# EAGLE design MEMS-preamp_v07 (EAGLE 8.5.0)
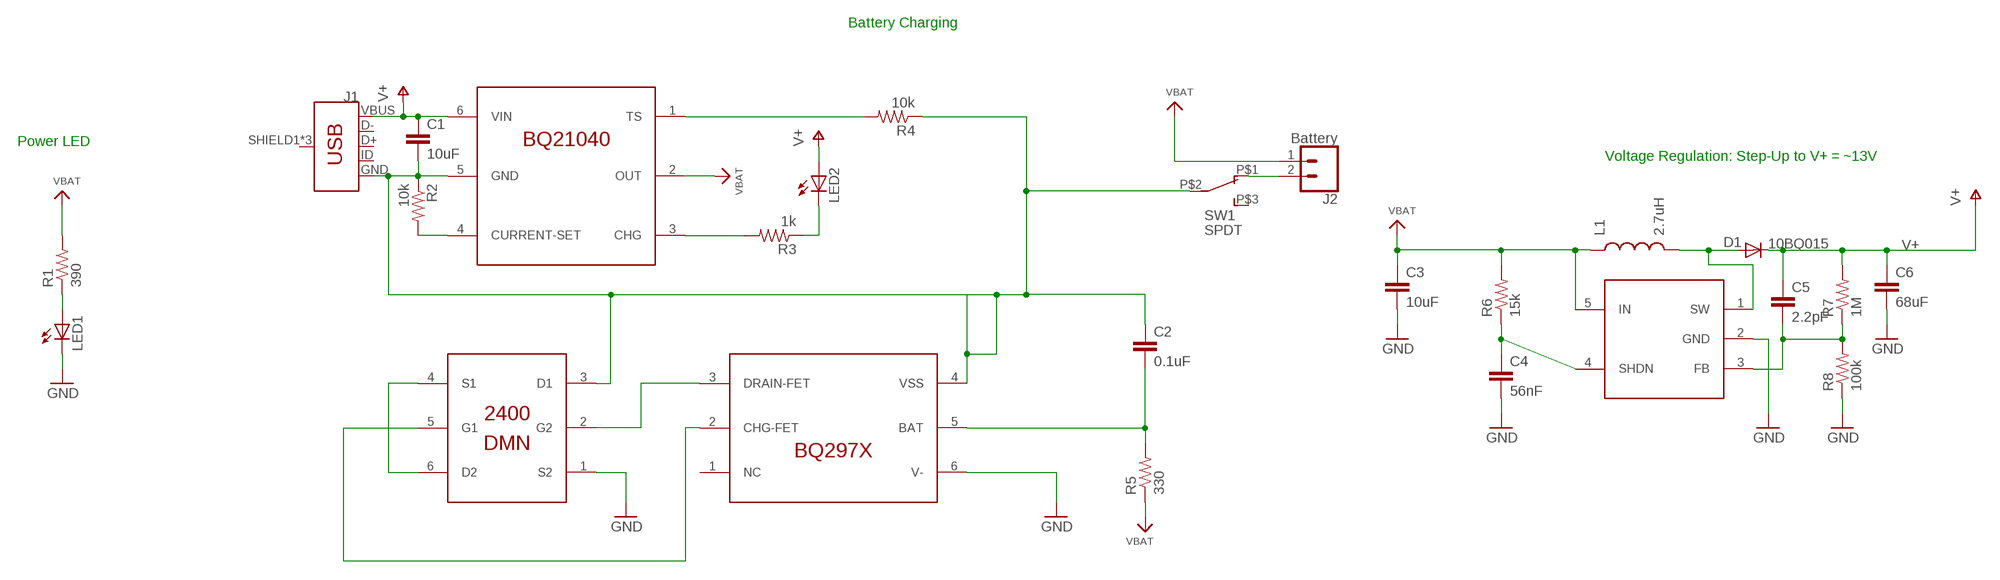
[diagram p0: schematic, sheet 1, part 1 of 2]
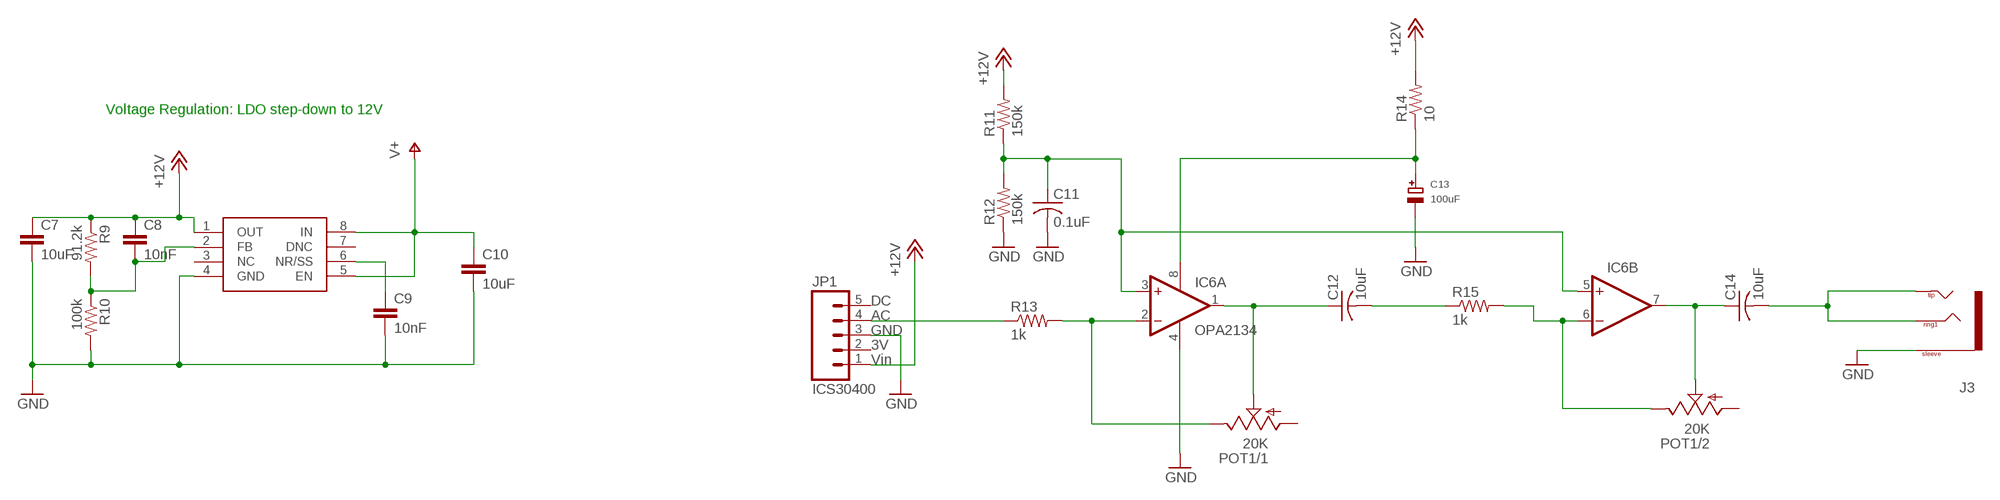
[diagram p1: schematic, sheet 1, part 2 of 2]

## Parts
C1  10uF  C-EUC0603  [C0603]
C2  0.1uF  C-EUC0603  [C0603]
C3  10uF  C-EUC0603  [C0603]
C4  56nF  C-EUC0603  [C0603]
C5  2.2pF  C-EUC0603  [C0603]
C6  68uF  C-EUC1206  [C1206]
C7  10uF  C-EUC0603  [C0603]
C8  10nF  C-EUC0603  [C0603]
C9  10nF  C-EUC0603  [C0603]
C10  10uF  C-EUC0603  [C0603]
C11  0.1uF  C-USC0805  [C0805]
C12  10uF  C-USC0805  [C0805]
C13  100uF  CAP_TANTALUMA/3216_REFLOW  [EIA3216-18/A-R]
C14  10uF  C-USC0805  [C0805]
D1  10BQ015  DIODESMA  [SMA-DIODE]
IC1  DMN2400  DUAL-NFET-DMN2400  [SOT-563]
IC2  BQ21040  BQ21040-LIPO-CHARGER  [SOT23-6]
IC3  BQ297X  BQ297X-BATTERY-MANAGER  [WSON-6]
IC4  SC4503  [SOT23-5]
IC5  TPS7A49  [MSOP-8]
IC6  OPA2134  OPA2134UA  [SO08]
J1  USB_MICRO-BREDUCED_PASTE  [USB-B-MICRO-SMD_RED_PASTE]
J2  Battery  CONN_02LOCK  [1X02_LOCK]
J3  TRS-1/8"-3.5MM  [TRS_SJ-3524-SMT]
JP1  ICS30400  M05LOCK  [1X05_LOCK]
L1  2.7uH  INDUCTORCR54-KIT  [CR54-KIT]
LED1  LED3MM  [LED3MM]
LED2  LED3MM  [LED3MM]
POT1  20K  POT-DUAL-PTV112-4420  [PTV112]
R1  390  R-US_R0603  [R0603]
R2  10k  R-US_R0603  [R0603]
R3  1k  R-US_R0603  [R0603]
R4  10k  R-US_R0603  [R0603]
R5  330  R-US_R0603  [R0603]
R6  15k  R-US_R0603  [R0603]
R7  1M  R-US_R0603  [R0603]
R8  100k  R-US_R0603  [R0603]
R9  91.2k  R-US_R0603  [R0603]
R10  100k  R-US_R0603  [R0603]
R11  150k  R-US_R0603  [R0603]
R12  150k  R-US_R0603  [R0603]
R13  1k  R-US_R0603  [R0603]
R14  10  R-US_R0603  [R0603]
R15  1k  R-US_R0603  [R0603]
SW1  SPDT  SWITCH_SPDTCL-SB-12B  [SWITCH_SPDT_CL-SB-12B]

## Nets
+12V: C7.1 C8.1 IC5.1(OUT) JP1.1 R9.1 R11.2 R14.2
GND: C3.2 C4.2 C6.2 C7.2 C9.2 C10.2 C11.2 C13.- IC1.1(S2) IC3.6(V-) IC5.4(GND) IC6.4(A:V-) J3.1(SLEEVE) JP1.3 LED1.K(C) R8.1 R10.2 R12.1
GND2: C1.2 C2.1 IC1.3(D1) IC2.5(GND) IC3.4(VSS) J1.GND R2.1 R4.1 SW1.P$2
GROU[: IC6.6(B:-IN) POT1.2.3(/2:E) R15.2
N$1: C13.+ IC6.8(A:V+) R14.1
N$2: LED1.A R1.1
N$3: JP1.4 R13.1
N$4: C12.2 R15.1
N$5: IC6.2(A:-IN) POT1.1.3(/1:E) R13.2
N$6: J2.2 SW1.P$1
N$7: C14.2 J3.2(TIP) J3.3(RING1) J3.4(TIP)
N$8: C11.1 IC6.3(A:+IN) IC6.5(B:+IN) R11.1 R12.2
N$9: C12.1 IC6.1(A:OUT) POT1.1.2(/1:S)
N$10: C14.1 IC6.7(B:OUT) POT1.2.2(/2:S)
N$11: LED2.K(C) R3.1
N$12: D1.A IC4.1(SW) L1.P$2
N$13: C4.1 IC4.4(SHDN) R6.1
N$14: C5.2 IC4.3(FB) R7.1 R8.2
N$15: IC2.3(CHG) R3.2
N$16: IC2.1(TS) R4.2
N$17: IC2.4(CURRENT-SET) R2.2
N$18: C2.2 IC3.5(BAT) R5.2
N$19: IC1.4(S1) IC1.6(D2)
N$20: IC1.5(G1) IC3.2(CHG-FET)
N$22: IC1.2(G2) IC3.3(DRAIN-FET)
N$47: C8.2 IC5.2(FB) R9.2 R10.1
N$48: C9.1 IC5.6(NR/SS)
V+: C1.1 C5.1 C6.1 C10.1 D1.C IC2.6(VIN) IC5.5(EN) IC5.8(IN) J1.VBUS LED2.A R7.2
VBAT: C3.1 IC2.2(OUT) IC4.5(IN) J2.1 L1.P$1 R1.2 R5.1 R6.2
Unconnected: IC3.1(NC) IC4.2(GND) IC5.3(NC) IC5.7(DNC) J1.D+ J1.D- J1.ID J1.SHIELD1(SHIELD) J1.SHIELD2(SHIELD) J1.SHIELD3(SHIELD) JP1.2 JP1.5 POT1.1.1(/1:A) POT1.2.1(/2:A) SW1.P$3

## Notes on the sheet
- Battery Charging
- Power LED
- Voltage Regulation: Step-Up to V+ = ~13V | Voltage Regulation: LDO step-down to 12V

## Library data of the parts
C1-C10 = rcl:C-EU: CAPACITOR, European symbol; SPICEPREFIX: C
C11 C12 C14 = adafruit:C-US: CAPACITOR, American symbol
C13 = microbuilder:CAP_TANTALUM: Tantalum Capacitors Wave footprints have larger pads and are meant to be used for hand soldering. Reflow footprints are optimised for solder paste and a reflow oven. EIA3216-18/A-[R/W] - Size A / 3216-18 / 1206 footprint 4.7µF 25V 10% Tantalum Capacitor 10µF 16V 10% Tantalum Capacitor [Digikey: 495-2236-2-ND] EIA3528-21/B-[R/W] - Size B / 3528-21 47µF 10V 10% Tantalum Capactior [Digikey: 495-2216-1-ND] EIA6032-28/C-[R/W] - Size C / 6032-28 10µF 35V 20% Tantalum Capacitor [Digikey: 495-2285-1-ND] 100µF 16V 10% Tantalum Capactior [Digikey: 399-5214-1-ND]
D1 = SparkFun:DIODE: Diode These are standard reverse protection diodes and small signal diodes. SMA package can handle up to about 1A. SOD-323 can handle about 200mA. What the SOD-323 package when ordering, there are some mfgs out there that are 5-pin packages.
IC1 = CMU-ArtFab:DUAL-NFET-DMN2400
IC2 = CMU-ArtFab:BQ21040-LIPO-CHARGER
IC3 = CMU-ArtFab:BQ297X-BATTERY-MANAGER
IC4 = CMU-ArtFab:SC4503
IC5 = CMU-ArtFab:TPS7A49
IC6 = linear:OPA2*: Dual Operational Amplifier Low Power, Single-Supply, Rail-To-Rail Operational Amplifier Source: http://focus.ti.com/lit/ds/symlink/opa2345.pdf http://focus.ti.com .. opa241.pdf http://focus.ti.com/lit/ds/symlink/opa2134.pdf; IC_NAME: OPA2134
J1 = SparkFun-Connectors:USB_MICRO-B: USB Type Micro-B Connector Male/female and PTH/SMT variants SparkFun Products: SparkFun microB USB Breakout <https://www.sparkfun.com/products/12035> SparkFun USB microB Plug Breakout <https://www.sparkfun.com/products/10031> SparkFun ESP8266 Thing <https://www.sparkfun.com/products/13231>; PROD_ID: CONN-11752
J2 = SparkFun-Connectors:CONN_02: Multi connection point. Often used as Generic Header-pin footprint for 0.1 inch spaced/style header connections On any of the 0.1 inch spaced packages, you can populate with these: Break Away Headers - Straight <https://www.sparkfun.com/products/116> (PRT-00116) Break Away Male Headers - Right Angle <https://www.sparkfun.com/products/553> (PRT-00553) Female Headers <https://www.sparkfun.com/products/115> (PRT-00115) Break Away Headers - Machine Pin <https://www.sparkfun.com/products/117> (PRT-00117) Break Away Female Headers - Swiss Machine Pin <https://www.sparkfun.com/products/743> (PRT-00743) For SCREWTERMINALS and SPRING TERMINALS visit here: Screw Terimnals on SparkFun.com <https://www.sparkfun.com/search/results?term=Screw+Terminals> (5mm/3.5mm/2.54mm spacing) This device is also useful as a general connection point to wire up your design to another part of your project. Our various solder wires solder well into these plated through hole pads. Hook-Up Wire - Assortment (Stranded, 22 AWG) <https://www.sparkfun.com/products/11375> (PRT-11375) Hook-Up Wire - Assortment (Solid Core, 22 AWG) <https://www.sparkfun.com/products/11367> (PRT-11367) View the entire wire category on our website here <https://www.sparkfun.com/categories/141> Special notes: Molex polarized connector foot print use with: PRT-08233 with associated crimp pins and housings. 2.54_SCREWTERM for use with PRT-10571. 3.5mm Screw Terminal footprints for PRT-08084 5mm Screw Terminal footprints for use with PRT-08432
J3 = CMU-ArtFab:TRS-1/8"-3.5MM
JP1 = SparkFun-Connectors:M05: Header 5 Standard 5-pin 0.1" header. Use with straight break away headers (SKU : PRT-00116), right angle break away headers (PRT-00553), swiss pins (PRT-00743), machine pins (PRT-00117), and female headers (PRT-00115). Molex polarized connector foot print use with SKU : PRT-08230 with associated crimp pins and housings.; CON1: Vin; CON2: 3V; CON3: GND; CON4: AC; CON5: DC
L1 = SparkFun-Passives:INDUCTOR: Inductors Basic Inductor/Choke - 0603 and 1206. Footprints are not proven and vary greatly between part numbers. SRN6045- 33uH, 20% 1.4A SDR0403-560KL - 56uH, 10%, 500mA RMS/740mA peak
LED1 LED2 = led:LED: LED OSRAM: - CHIPLED LG R971, LG N971, LY N971, LG Q971, LY Q971, LO R971, LY R971 LH N974, LH R974 LS Q976, LO Q976, LY Q976 LO Q996 - Hyper CHIPLED LW Q18S LB Q993, LB Q99A, LB R99A - SideLED LS A670, LO A670, LY A670, LG A670, LP A670 LB A673, LV A673, LT A673, LW A673 LH A674 LY A675 LS A676, LA A676, LO A676, LY A676, LW A676 LS A679, LY A679, LG A679 - Hyper Micro SIDELED® LS Y876, LA Y876, LO Y876, LY Y876 LT Y87S - SmartLED LW L88C, LW L88S LB L89C, LB L89S, LG L890 LS L89K, LO L89K, LY L89K LS L896, LA L896, LO L896, LY L896 - TOPLED LS T670, LO T670, LY T670, LG T670, LP T670 LSG T670, LSP T670, LSY T670, LOP T670, LYG T670 LG T671, LOG T671, LSG T671 LB T673, LV T673, LT T673, LW T673 LH T674 LS T676, LA T676, LO T676, LY T676, LB T676, LH T676, LSB T676, LW T676 LB T67C, LV T67C, LT T67C, LS T67K, LO T67K, LY T67K, LW E67C LS E67B, LA E67B, LO E67B, LY E67B, LB E67C, LV E67C, LT E67C LW T67C LS T679, LY T679, LG T679 LS T770, LO T770, LY T770, LG T770, LP T770 LB T773, LV T773, LT T773, LW T773 LH T774 LS E675, LA E675, LY E675, LS T675 LS T776, LA T776, LO T776, LY T776, LB T776 LHGB T686 LT T68C, LB T68C - Hyper Mini TOPLED® LB M676 - Mini TOPLED Santana® LG M470 LS M47K, LO M47K, LY M47K Source: http://www.osram.convergy.de LUXEON: - LUMILED® LXK2-PW12-R00, LXK2-PW12-S00, LXK2-PW14-U00, LXK2-PW14-V00 LXK2-PM12-R00, LXK2-PM12-S00, LXK2-PM14-U00 LXK2-PE12-Q00, LXK2-PE12-R00, LXK2-PE12-S00, LXK2-PE14-T00, LXK2-PE14-U00 LXK2-PB12-K00, LXK2-PB12-L00, LXK2-PB12-M00, LXK2-PB14-N00, LXK2-PB14-P00, LXK2-PB14-Q00 LXK2-PR12-L00, LXK2-PR12-M00, LXK2-PR14-Q00, LXK2-PR14-R00 LXK2-PD12-Q00, LXK2-PD12-R00, LXK2-PD12-S00 LXK2-PH12-R00, LXK2-PH12-S00 LXK2-PL12-P00, LXK2-PL12-Q00, LXK2-PL12-R00 Source: www.luxeon.com KINGBRIGHT: KA-3528ASYC Source: www.kingbright.com
POT1 = CMU-ArtFab:POT-DUAL-PTV112: Bourns 11mm dual potentiometer; AVAILABILITY: Unavailable; DESCRIPTION: Alt# Tce-10111410; MF: STMicroelectronics; MP: PTV112; PACKAGE: None; PRICE: None
R1-R15 = CMU-ArtFab:R-US_: RESISTOR, American symbol
SW1 = CMU-ArtFab:SWITCH_SPDT

## Board
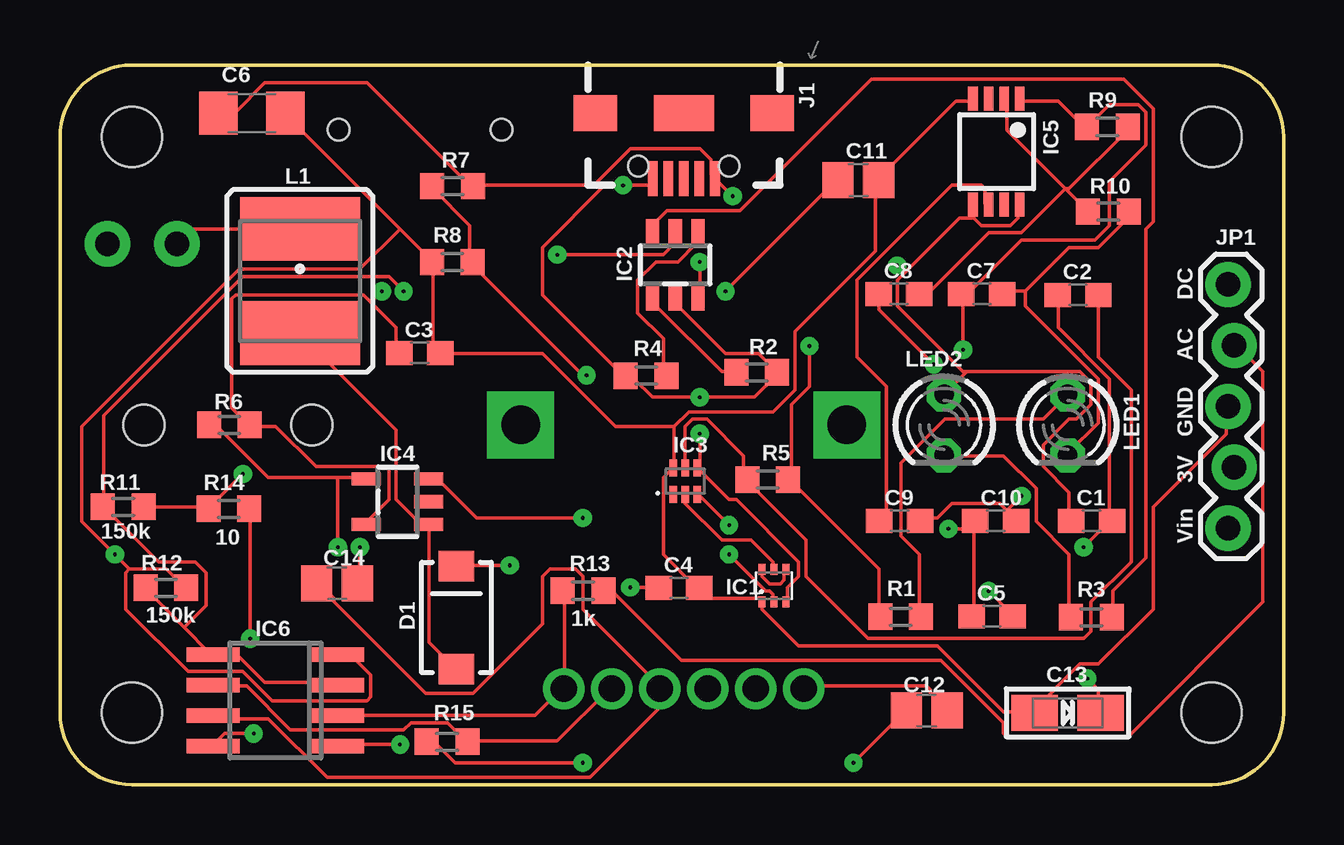
[diagram p2: board, top side]
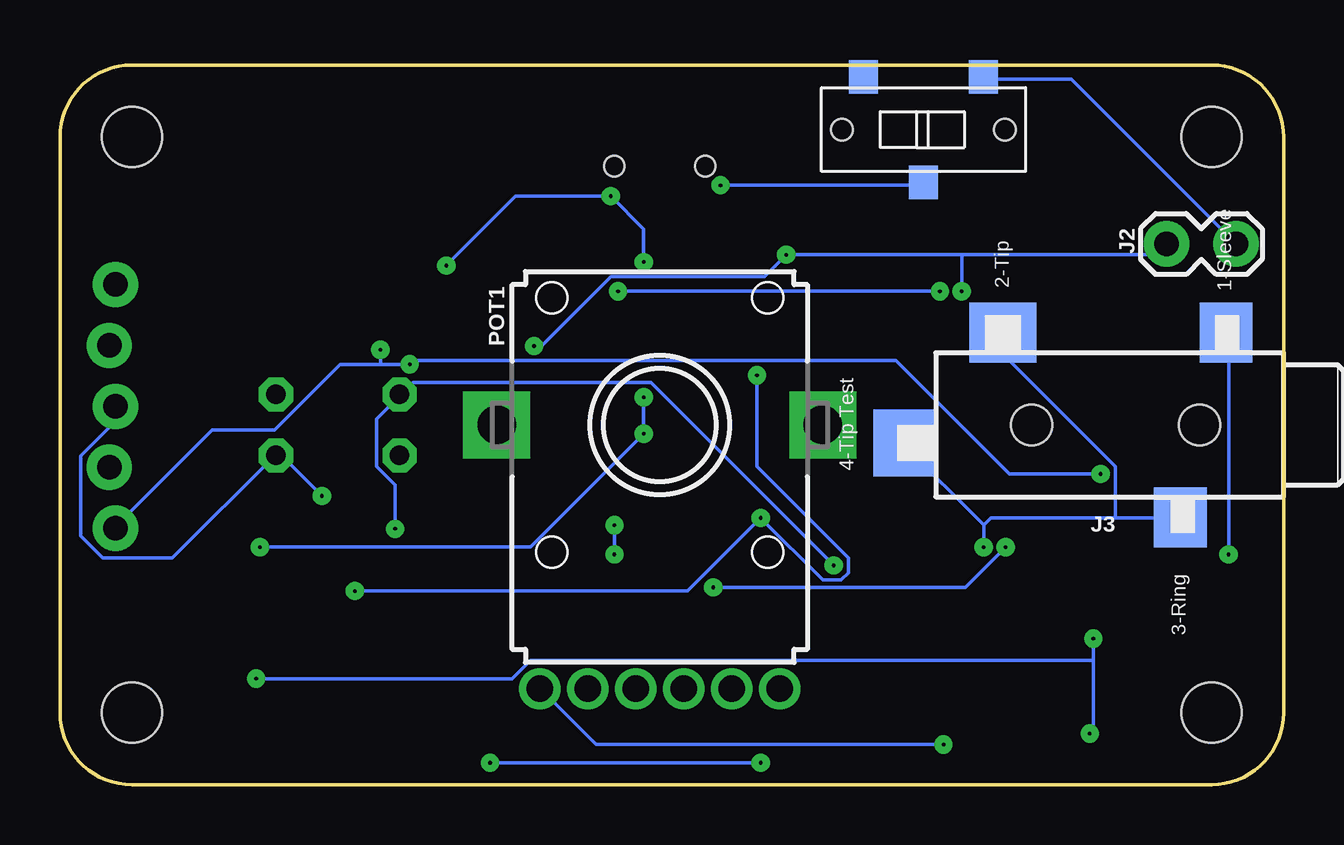
[diagram p3: board, bottom side, seen from below]

Size 51 x 30 mm. Coordinates in mm from the lower left corner, seen from the top.
Outline: 0,3 0,27 arc-90 3,30 48,30 arc-90 51,27 51,3 arc-90 48,0 3,0 arc-90 0,3
Copper layers (1*16): Top 0.035mm / dielectric 1.5mm / Bottom 0.035mm
Design rules "default *": minimum track width 6mil, minimum drill 6mil, track to track 6mil, track to pad 6mil, pad to pad 6mil, via to via 6mil, smd to smd 6mil, copper to edge 6mil, drill to drill 6mil, minimum pad ring 12mil, minimum via ring 12mil, stop-mask expansion 4mil, vias tented up to drill 0mil, thermal gap 10mil
Holes 2.5 mm at 48,27 48,3 3,27 3,3

### Footprints (pad centres in the part's own frame; a part is rotated, then mirrored left to right if it is on the bottom)
C0603 = smd 1.1 x 1: 1 -0.85,0; 2 0.85,0
C1206 = smd 1.6 x 1.8: 1 -1.4,0; 2 1.4,0
C0805 = smd 1.3 x 1.5: 1 -0.85,0; 2 0.85,0
EIA3216-18/A-R = smd 1.95 x 1.5: + 1.375,0; - -1.375,0
SMA-DIODE = smd 1.27 x 1.47: A -2.15,0; C 2.15,0
SOT-563 = smd 0.3 x 0.45: 1 -0.5,-0.675; 2 0,-0.675; 3 0.5,-0.675; 4 0.5,0.675; 5 0,0.675; 6 -0.5,0.675
SOT23-6 = smd 0.55 x 1.2: 1 -0.95,-1.3; 2 0,-1.3; 3 0.95,-1.3; 4 0.95,1.3; 5 0,1.3; 6 -0.95,1.3
WSON-6 = smd 0.3 x 0.7: 1 -0.5,-0.55; 2 0,-0.55; 3 0.5,-0.55; 4 0.5,0.55; 5 0,0.55; 6 -0.5,0.55
SOT23-5 = smd 0.55 x 1.2: 1 -0.95,-1.3; 2 0,-1.3; 3 0.95,-1.3; 4 0.95,1.3; 5 -0.95,1.3
MSOP-8 = smd 0.4 x 1: 1 -0.975,-2.2; 2 -0.325,-2.2; 3 0.325,-2.2; 4 0.975,-2.2; 5 0.975,2.2; 6 0.325,2.2; 7 -0.325,2.2; 8 -0.975,2.2
SO08 = smd 0.6 x 2.2: 1 -1.905,-2.6; 2 -0.635,-2.6; 3 0.635,-2.6; 4 1.905,-2.6; 5 1.905,2.6; 6 0.635,2.6; 7 -0.635,2.6; 8 -1.905,2.6
USB-B-MICRO-SMD_RED_PASTE = smd 1.45 x 0.4: D+ 2.725,0; D- 2.725,0.65; GND 2.725,-1.3; ID 2.725,-0.65; VBUS 2.725,1.3 | smd 1.5 x 1.8: SHIELD1 0,3.685; SHIELD2 0,-3.685 | smd 1.5 x 2.5: SHIELD3 0,0 | hole 0.85: 2.2,1.9; 2.2,-1.9
1X02_LOCK = drill 1.016 pad 1.88: 1 -0.178,0; 2 2.718,0
TRS_SJ-3524-SMT = smd 2.5 x 2.2: 1 3.85,-4.6; 3 -3.85,-2.7 | smd 2.5 x 2.8: 2 3.85,4.7 | smd 2.8 x 2.5: 4 -0.75,8.85 | hole 1.7: 0,-3.5; 0,3.5
1X05_LOCK = drill 1.016 pad 1.88: 1 0,0.127; 2 2.54,-0.127; 3 5.08,0.127; 4 7.62,-0.127; 5 10.16,0.127
CR54-KIT = smd 5 x 2.65: P$1 0,2.17; P$2 0,-2.17
LED3MM = drill 0.813 octagon: A -1.27,0; K 1.27,0
PTV112 = drill 1.1 pad 1.676: 1.1 -3,-11; 1.2 -5,-11; 1.3 5,-11; 2.1 -1,-11; 2.2 1,-11; 2.3 3,-11 | drill 1.6 pad 2.8 square: M1 -6.8,0; M2 6.8,0
R0603 = smd 1 x 1.1: 1 -0.85,0; 2 0.85,0
SWITCH_SPDT_CL-SB-12B = smd 1.2 x 1.4: P$1 -2.5,-2.2; P$2 0,2.2; P$3 2.5,-2.2 | hole 0.9: -3.4,0; 3.4,0

### Placement (x,y rotation side)
C1  43,11 0 top
C2  42.43,20.42 0 top
C3  15,18 0 top
C4  25.8,8.2 0 top
C5  38.85,7.02 0 top
C6  8,28 0 top
C7  38.42,20.46 0 top
C8  34.97,20.46 0 top
C9  35,11 0 top
C10  39,11 0 top
C11  33.27,25.2 0 top
C12  36.13,3.1 180 top
C13  42,3 0 top
C14  11.54,8.4 0 top
D1  16.53,6.97 90 top
IC1  29.77,8.3 0 top
IC2  25.64,21.67 180 top
IC3  26.06,12.66 0 top
IC4  14.06,11.8 90 top
IC5  39.02,26.39 180 top
IC6  8.98,3.52 90 top
J1  26,27.99 270 top
J2  4.7,22.55 0 bottom
J3  7,15 90 bottom
JP1  48.81,10.7 90 top
L1  10,21 0 top
LED1  42,15 270 top
LED2  36.85,15 270 top
POT1  26,15 0 bottom
R1  35.04,7 180 top
R2  29.04,17.19 180 top
R3  42.99,6.98 0 top
R4  24.43,17.06 0 top
R5  29.5,12.72 180 top
R6  7.06,15 0 top
R7  16.36,24.96 0 top
R8  16.35,21.79 0 top
R9  43.65,27.43 0 top
R10  43.69,23.89 0 top
R11  2.64,11.59 0 top
R12  4.42,8.21 180 top
R13  21.8,8.09 180 top
R14  7.04,11.51 180 top
R15  16.14,1.79 0 top
SW1  15.01,27.32 180 bottom

### Tracks (layer width: path | path; a pad name or v marks a point on that pad's centre or on a via)
+12V  (via drill 0.15)
  Top 0.152: IC5.1 40.08,28.5 41.6,28.5 42.67,27.43 R9.1 42.82,27.43 43.74,28.35 44.96,28.35 45.26,28.04 45.26,26.67 43.74,25.15 43.74,23.32 43.13,22.71 40.08,22.71 37.95,20.57 37.64,20.57 C7.1 37.64,20.42 v37.64,18.14 | R11.2 3.5,11.58 6.1,11.58 R14.2 6.25,11.58 v7.62,12.95 | v36.42,17.53 34.14,19.81 34.14,20.42 C8.1
  Bottom 0.152: 37.64,17.53 39.32,17.53 42.06,14.78 44.65,14.78 48.62,10.82 JP1.1 | 37.64,17.53 v36.42,17.53 36.27,17.68 16.15,17.68 11.43,12.95 v7.62,12.95 | 37.64,17.53 v37.64,18.14
GND  (via drill 0.15)
  Top 0.152: 40.23,20.57 39.32,20.57 C7.2 | 40.23,20.57 42.06,22.4 43.28,22.4 44.65,23.77 R10.2 | 39.47,11.43 39.78,11.12 C10.2 39.47,11.43 | 39.47,11.43 39.17,11.73 37.19,11.73 36.58,11.12 35.97,11.12 C9.2 | v40.08,12.04 39.47,11.43 | 40.23,20.57 40.23,19.96 43.28,16.92 43.28,15.09 42.06,13.87 LED1.K | 2.9,8.99 4.42,8.99 5.18,8.23 R12.1 | 2.9,8.99 2.74,8.84 2.74,7.32 5.33,4.72 7.62,4.72 8.84,3.5 12.8,3.5 12.95,3.66 12.95,4.57 12.19,5.33 11.73,5.33 IC6.4 | 2.9,8.99 v2.29,9.6 0.91,10.97 0.91,14.94 7.47,21.49 12.5,21.49 14.17,23.16 | 14.17,23.16 15.54,21.79 R8.1 15.54,21.64 15.54,18.44 15.85,18.14 C3.2 16,17.98 20.12,17.98 23.16,14.94 25.6,14.94 | 14.17,23.16 9.45,27.89 C6.2 | IC5.4 37.95,28.5 37.34,28.5 34.14,25.3 C11.2 33.98,25.15 33.98,22.25 30.63,18.9 30.63,16.46 29.72,15.54 26.21,15.54 25.6,14.94 | 40.54,3.05 39.32,3.05 36.58,5.79 30.79,5.79 29.26,7.32 IC1.1 29.26,7.77 26.98,7.77 26.67,8.08 C4.2 26.52,8.23 25.15,9.6 25.15,12.8 25.45,13.11 IC3.6 25.6,13.26 25.6,14.94 | 40.54,3.05 42.52,5.03 43.28,5.03 45.57,7.32 45.57,11.58 48.62,14.63 48.62,15.7 JP1.3 | 40.54,3.05 C13.-
  Bottom 0.152: v40.08,12.04 41.91,13.87 LED1.K 42.06,13.72 46.33,9.45 49.23,9.45 50.14,10.36 50.14,13.72 48.77,15.09 48.77,15.7 JP1.3 | v2.29,9.6 2.29,18.75 J3.1
GND2  (via drill 0.15)
  Top 0.152: C2.1 41.6,20.27 41.6,19.05 43.74,16.92 43.74,11.12 C1.2 43.74,10.97 v42.67,9.91 | J1.GND 24.69,25.15 24.54,24.99 v23.47,24.99 22.71,24.99 20.12,22.4 20.12,20.42 23.47,17.07 R4.1 23.62,16.92 23.93,16.92 24.69,16.15 v26.67,16.15 28.96,16.15 29.87,17.07 R2.1 29.87,17.22 29.11,17.98 27.74,17.98 25.76,19.96 25.76,20.27 IC2.5 | IC1.3 30.33,7.77 30.33,8.23 30.79,8.69 30.79,9.3 28.19,11.89 27.89,11.89 26.67,13.11 IC3.4 26.67,13.26 v26.67,14.63
  Bottom 0.152: v23.47,24.99 15.09,24.99 SW1.P$2 | v26.67,16.15 v26.67,14.63 31.39,9.91 v42.67,9.91
GROU[
  Top 0.152: POT1.2.3 22.86,3.96 20.73,1.83 17.07,1.83 R15.2 16.92,1.83 16.15,2.59 14.63,2.59 14.33,2.29 9.6,2.29 7.77,4.12 6.4,4.12 IC6.6
N$1  (via drill 0.15)
  Top 0.152: v7.92,6.1 7.92,11.43 R14.1 | v8.08,2.13 6.86,2.13 6.4,1.68 IC6.8 | v42.82,4.42 43.28,3.96 43.28,3.05 C13.+
  Bottom 0.152: 7.92,5.18 7.92,2.29 v8.08,2.13 | 7.92,5.18 v7.92,6.1 | v42.82,4.42 32.16,4.42 31.39,5.18 7.92,5.18
N$2
  Top 0.152: R1.1 35.81,7.01 35.81,9.6 35.05,10.36 35.05,13.41 36.88,15.24 41,15.24 41.91,16.15 LED1.A
N$3
  Top 0.152: R13.1 22.71,8.08 23.01,8.08 25.91,5.18 36.73,5.18 39.32,2.59 39.32,2.13 39.47,1.98 44.5,1.98 50.14,7.62 50.14,17.22 49.07,18.29 JP1.4
N$4  (via drill 0.15)
  Top 0.152: v21.79,0.91 16.46,0.91 15.7,1.68 15.39,1.68 R15.1 | v33.07,0.91 35.2,3.05 C12.2
  Bottom 0.152: v33.07,0.91 v21.79,0.91
N$5
  Top 0.152: R13.2 21.03,8.08 21.03,4.12 POT1.1.3 20.88,3.96 19.81,2.9 11.73,2.9 IC6.2
N$6
  Bottom 0.152: SW1.P$1 12.5,29.41 8.84,29.41 J2.2
N$7  (via drill 0.15)
  Top 0.152: v12.5,9.91 12.5,8.53 C14.2
  Bottom 0.152: 12.5,10.82 v12.5,9.91 | 12.5,10.82 15.85,14.17 J3.4 | 7.01,11.12 12.19,11.12 12.5,10.82 | 7.01,11.12 4.42,11.12 J3.3 | 7.01,11.12 7.01,13.26 11.58,17.83 11.58,18.75 J3.2
N$8  (via drill 0.15)
  Top 0.152: 5.18,6.55 6.25,5.49 IC6.5 6.4,5.33 7.47,5.33 8.53,4.27 11.58,4.27 IC6.3 | 5.18,6.55 3.66,8.08 R12.2 | 5.18,6.55 6.1,7.47 6.1,8.84 5.64,9.3 4.12,9.3 1.83,11.58 R11.1 1.83,11.73 1.83,15.39 7.62,21.18 13.72,21.18 v14.33,20.57 | v27.74,20.57 32.31,25.15 C11.1
  Bottom 0.152: v14.33,20.57 v27.74,20.57
N$9  (via drill 0.15)
  Top 0.152: C12.1 36.88,3.2 36.27,3.81 36.27,3.96 36.12,4.12 31.09,4.12 POT1.1.2 | v14.17,1.68 11.73,1.68 IC6.1
  Bottom 0.152: v14.17,1.68 28.65,1.68 30.94,3.96 POT1.1.2
N$10
  Top 0.152: C14.1 10.82,8.38 11.43,7.77 11.43,7.62 15.24,3.81 17.22,3.81 20.12,6.71 20.12,8.69 20.42,8.99 21.49,8.99 21.79,8.69 21.79,7.32 24.99,4.12 POT1.2.2 24.99,3.96 24.99,3.2 22.1,0.3 11.12,0.3 8.69,2.74 6.4,2.74 IC6.7
N$11
  Top 0.152: R3.1 42.06,7.01 42.06,9.6 40.69,10.97 40.69,12.34 39.32,13.72 36.88,13.72 LED2.K
N$12
  Top 0.152: D1.A 16.46,4.88 15.39,5.94 15.39,10.82 IC4.1 15.24,10.97 14.94,10.97 14.02,11.89 14.02,14.78 10.06,18.75 L1.P$2
N$13  (via drill 0.15)
  Top 0.152: 11.58,12.8 12.65,12.8 IC4.4 | 11.58,12.8 8.69,12.8 6.55,14.94 6.25,14.94 R6.1 | v23.77,8.23 24.84,8.23 C4.1 | 11.58,12.8 v11.58,9.91
  Bottom 0.152: v23.77,8.23 13.26,8.23 v11.58,9.91
N$14  (via drill 0.15)
  Top 0.152: R7.1 15.54,24.84 17.07,23.32 17.07,21.79 R8.2 17.22,21.64 21.79,17.07 v21.95,17.07 | v38.71,8.08 39.62,7.16 C5.2 | v21.79,11.12 17.37,11.12 15.85,12.65 15.39,12.65 IC4.3
  Bottom 0.152: v38.71,8.08 24.84,8.08 v21.79,11.12 19.2,8.53 18.44,8.53 18.14,8.84 18.14,9.45 21.95,13.26 v21.95,17.07
N$15
  Top 0.152: R3.2 43.89,7.01 43.89,8.08 45.26,9.45 45.26,23.16 45.57,23.47 45.57,28.19 44.35,29.41 33.83,29.41 28.35,23.93 25.3,23.93 24.84,23.47 24.84,23.01 IC2.3
N$16
  Top 0.152: R4.2 25.15,17.07 25.15,18.59 24.08,19.66 24.08,21.03 24.84,21.79 25.76,21.79 26.52,22.55 26.52,22.86 IC2.1
N$17
  Top 0.152: R2.2 28.04,17.22 27.58,17.22 24.84,19.96 24.84,20.27 IC2.4
N$18
  Top 0.152: IC3.5 26.06,13.26 26.06,14.94 26.36,15.24 26.98,15.24 28.5,13.72 28.5,12.8 R5.2 28.65,12.65 31.09,10.21 31.09,8.69 33.68,6.1 42.67,6.1 42.98,6.4 42.98,7.62 44.65,9.3 44.65,16.46 43.28,17.83 43.28,20.27 C2.2
N$19
  Top 0.152: IC1.6 29.26,8.84 29.26,8.69 29.57,8.38 30.02,8.38 30.18,8.53 30.18,8.84 IC1.4
N$20
  Top 0.152: IC1.5 29.72,8.99 29.72,9.3 28.8,10.21 27.58,10.21 26.06,11.73 26.06,12.04 IC3.2
N$22  (via drill 0.15)
  Top 0.152: v27.89,9.6 29.41,8.08 29.57,8.08 29.72,7.92 29.72,7.77 IC1.2 | v27.89,10.82 26.67,12.04 IC3.3
  Bottom 0.152: v27.89,10.82 v27.89,9.6
N$47
  Top 0.152: 41.91,24.84 42.82,23.93 R10.1 | 41.91,24.84 39.47,27.28 39.47,28.5 IC5.2 | 41.91,24.84 40.08,23.01 38.71,23.01 36.27,20.57 35.97,20.57 C8.2 | 41.91,24.84 42.06,24.84 44.5,27.28 R9.2
N$48
  Top 0.152: IC5.6 38.56,24.23 38.56,24.84 38.41,24.99 37.19,24.99 33.22,21.03 33.22,17.83 34.44,16.61 34.44,11.28 34.29,11.12 C9.1
V+  (via drill 0.15)
  Top 0.152: v26.67,21.79 26.67,20.42 IC2.6 | v28.04,24.54 27.43,25.15 J1.VBUS 27.28,25.3 27.13,25.45 27.13,26.06 26.67,26.52 23.77,26.52 22.25,24.99 17.22,24.99 R7.2 17.07,24.99 12.8,29.26 8.53,29.26 7.32,28.04 6.71,28.04 C6.1 | 38.1,10.67 38.1,10.97 C10.1 38.1,10.67 | 38.1,10.67 38.1,7.16 C5.1 | 38.1,23.62 38.1,24.08 IC5.5 | 38.1,23.62 38.41,23.32 39.62,23.32 39.93,23.62 39.93,24.08 IC5.8 | 37.8,17.22 42.52,17.22 42.98,16.76 42.98,15.85 42.37,15.24 42.06,15.24 41,14.17 41,13.26 42.06,12.19 42.06,11.12 C1.1 | 37.8,17.22 36.88,16.31 LED2.A | v18.75,9.14 16.61,9.14 D1.C | 38.1,23.62 37.49,23.62 35.2,21.34 | 35.2,21.34 34.9,21.03 34.9,19.96 37.64,17.22 37.8,17.22 | v37.03,10.67 38.1,10.67 | 35.2,21.34 v34.9,21.64
  Bottom 0.152: v26.67,21.79 26.67,23.16 v28.04,24.54 32,24.54 v34.9,21.64 | v18.75,9.14 26.36,16.76 36.27,16.76 36.73,16.31 LED2.A 36.88,16.15 37.8,15.24 37.8,13.26 37.03,12.5 v37.03,10.67
VBAT  (via drill 0.15)
  Top 0.152: IC4.5 12.8,10.97 13.72,11.89 13.72,13.11 13.56,13.26 10.67,13.26 8.99,14.94 7.92,14.94 R6.2 7.77,15.09 7.16,15.7 7.16,20.27 7.32,20.42 12.65,20.42 12.95,20.12 | 12.95,20.12 14.02,19.05 14.02,18.14 C3.1 | R1.2 34.14,7.01 34.14,8.99 30.48,12.65 R5.1 30.48,12.8 30.48,15.85 31.24,16.61 v31.24,18.29 | v20.73,22.1 25.15,22.1 25.6,22.55 25.6,22.86 IC2.2 | L1.P$1 9.91,23.16 5.49,23.16 J2.1 | v13.41,20.57 12.95,20.12
  Bottom 0.152: 13.41,22.1 5.18,22.1 4.88,22.4 J2.1 | 13.41,22.1 v20.73,22.1 21.64,21.18 28.04,21.18 30.94,18.29 v31.24,18.29 | 13.41,22.1 v13.41,20.57